# Altium schematic sheet 358漫&镜面反射.SchDoc
size 400 x 400 mm; SheetNumber: 1; SheetTotal: 1
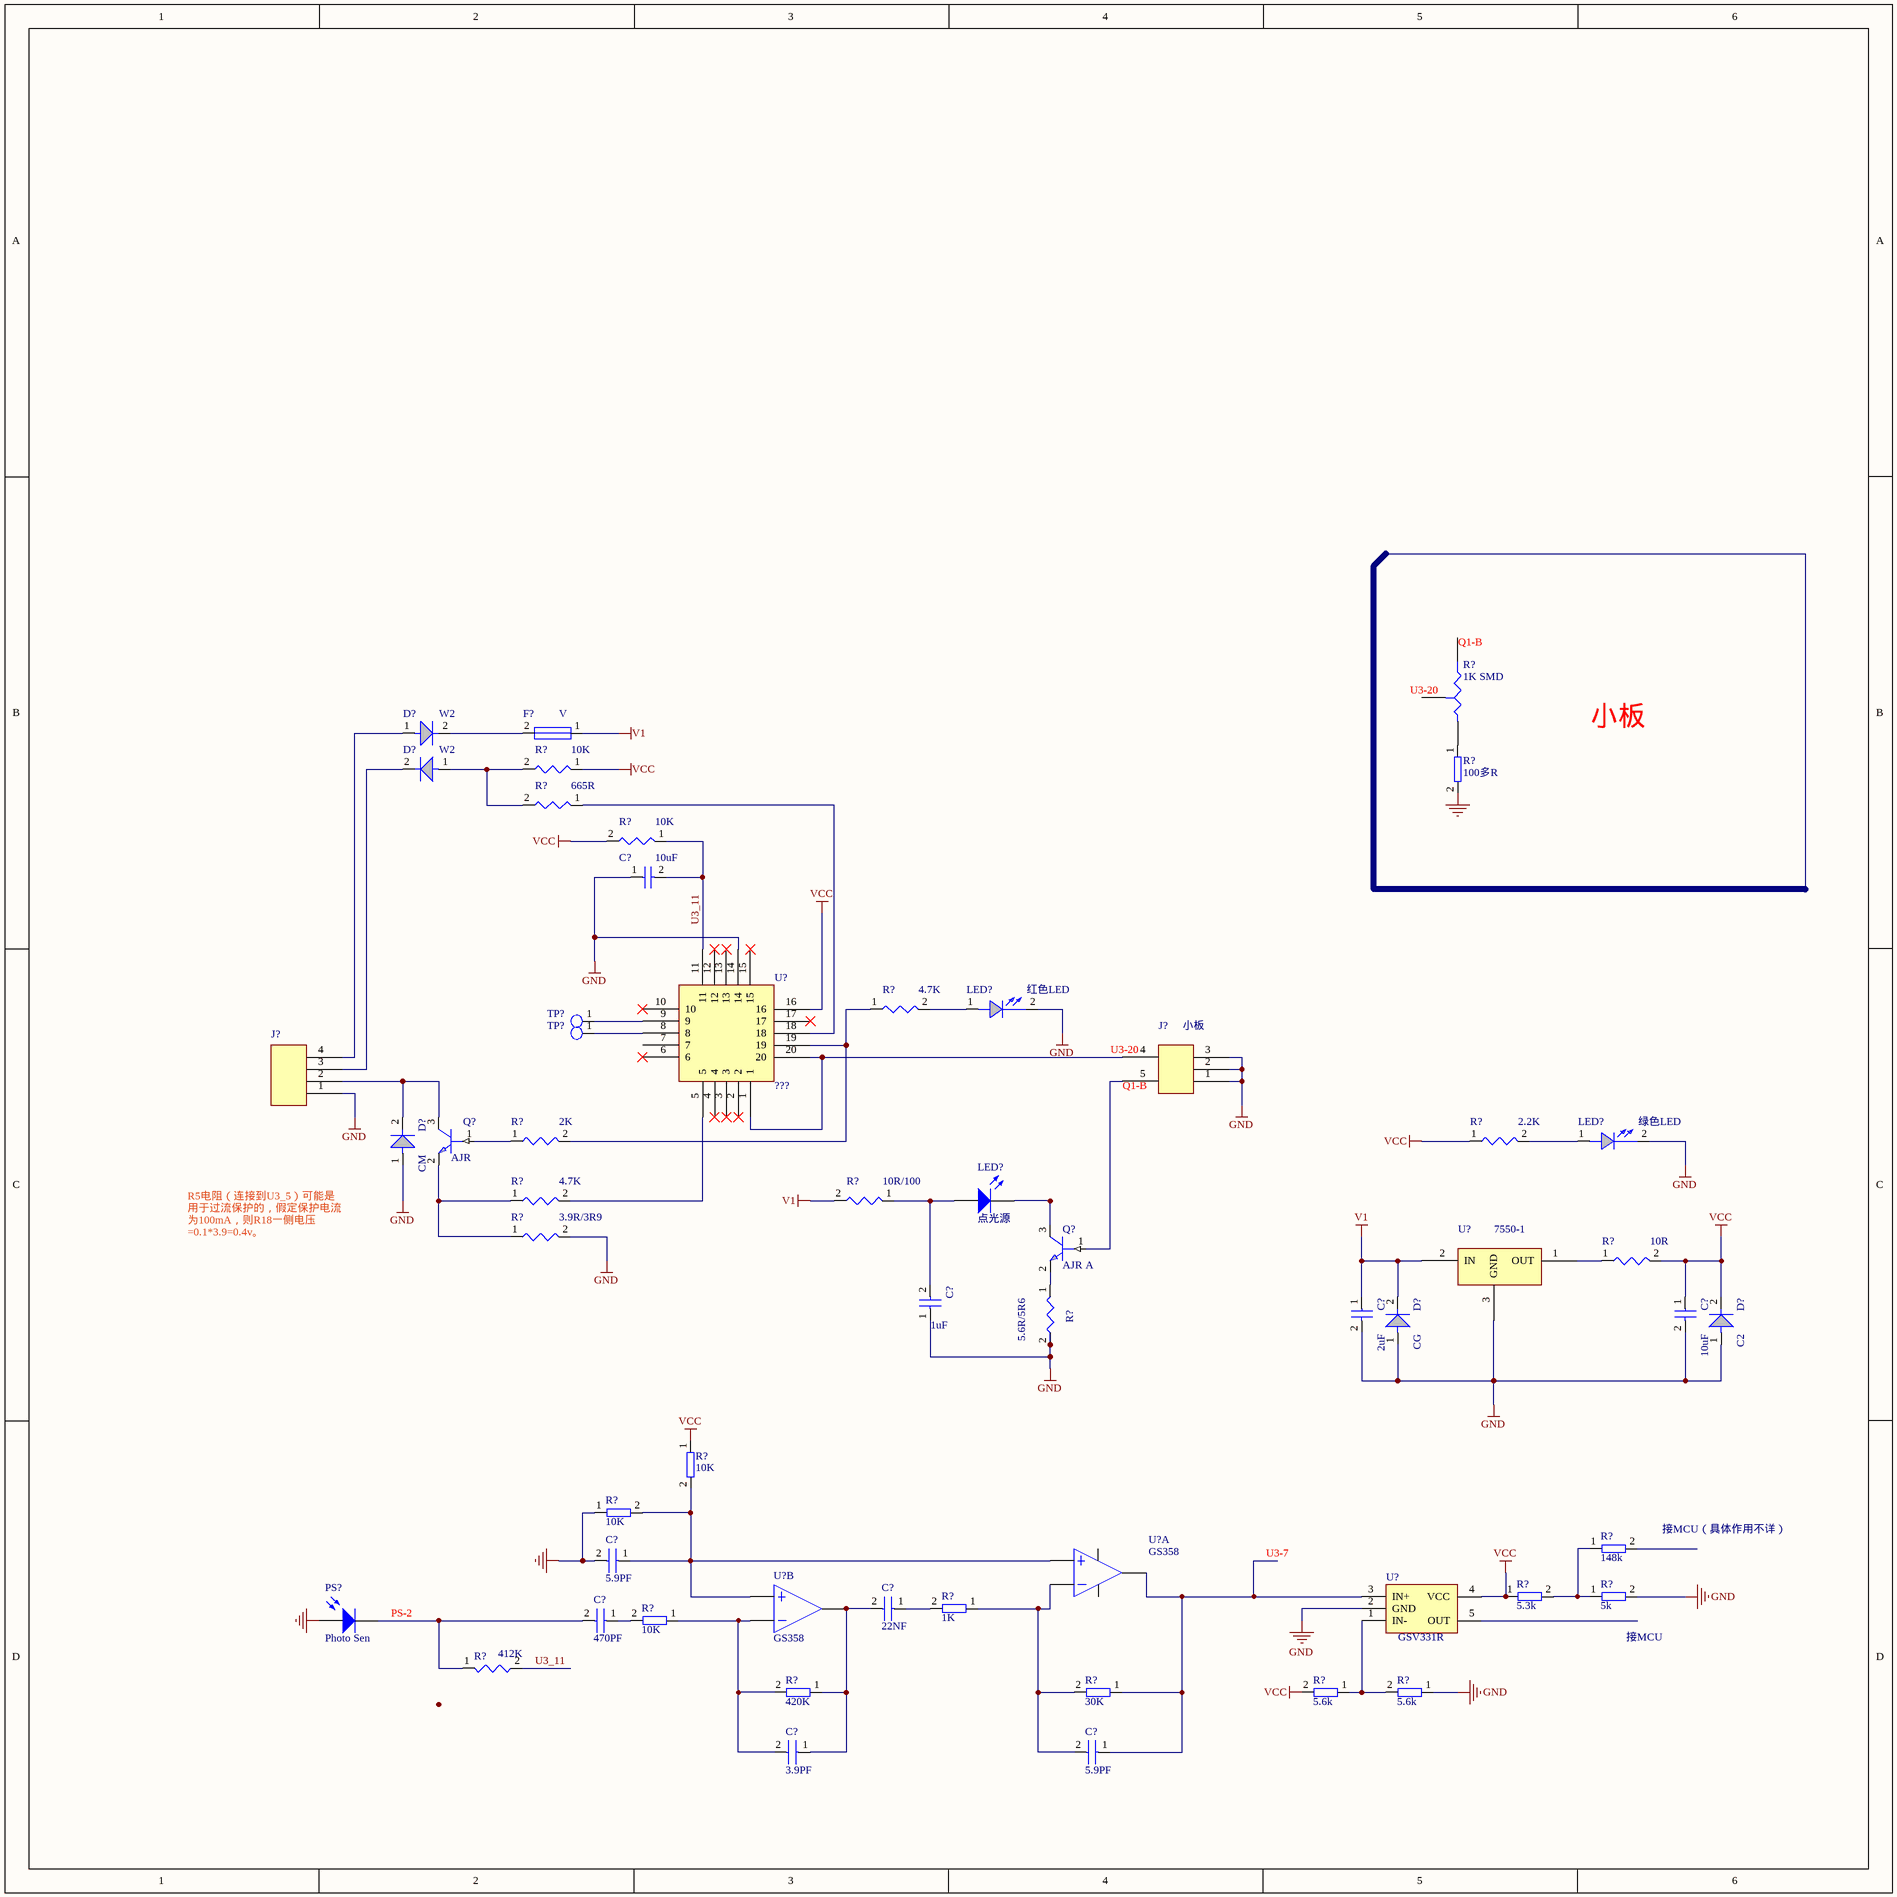
[diagram p0: 358漫&镜面反射.SchDoc]

## Parts
(Parts that share a designator on the sheet are numbered #1, #2 ... from top to bottom, then left to right.)
C?#1  10uF  [0603]
C?#2  1uF  [1206]
C?#3  2uF  [1206]
C?#4  10uF  [0603]
C?#5  5.9PF
C?#6  22NF
C?#7  470PF
C?#8  3.9PF
C?#9  5.9PF
D?#1  W2  [0805]
D?#2  W2  [0805]
D?#3  CM  [1206]
D?#4  CG  [1206]
D?#5  C2  [0805]
F?  V  [0805]
J?#1  小板  [SIP5P]
J?#2  (no value)  [SIP4]
LED?#1  红色LED  [0603V]
LED?#2  绿色LED  [0603V]
LED?#3  点光源  [LED-0]
PS?  Photo Sen  [PIN2]
Q?#1  AJR  [SOT-23]
Q?#2  AJR A  [SOT-23]
R?#1  value 1K SMD  [VR3]  (hidden comment: Res Tap)
R?#2  100多R
R?#3  10K  [0402]
R?#4  665R  [0402]
R?#5  10K  [0402]
R?#6  4.7K  [0402]
R?#7  2K  [0402]
R?#8  2.2K  [0402]
R?#9  4.7K  [0402]
R?#10  10R/100  [0603]
R?#11  3.9R/3R9  [0805]
R?#12  10R  [0402]
R?#13  5.6R/5R6  [0603V]
R?#14  10K
R?#15  10K
R?#16  148k
R?#17  5.3k
R?#18  5k
R?#19  1K
R?#20  10K
R?#21  412K  [0402]
R?#22  420K
R?#23  30K
R?#24  5.6k
R?#25  5.6k
TP?#1  (no value)  [SIP1]
TP?#2  (no value)  [SIP1]
U?#1  ???  [QFN20]
U?#2  7550-1  [SOT89]
U?#3  GS358  [SOP-8]  (part A of 2)
U?#4  GS358  [SOP-8]  (part B of 2)
U?#5  GSV331R  [SC70]

## Nets
GND: C?#1.1 C?#2.1 C?#3.2 C?#4.2 C?#5.2 D?#3.1 D?#4.1 D?#5.1 J?#1.1 J?#1.2 J?#1.3 J?#2.1 LED?#1.2(CATHODE) LED?#2.2(CATHODE) PS?.1(A) R?#2.2 R?#11.2 R?#13.2 R?#15.1 R?#18.2 R?#25.1 U?#1.14 U?#2.3(GND) U?#5.2(GND)
V1: C?#3.1 D?#4.2 F?.1 R?#10.2 U?#2.2(IN)
VCC: C?#4.1 D?#5.2 R?#3.1 R?#5.2 R?#8.1 R?#12.2 R?#14.1 R?#17.1 R?#24.2 U?#1.16 U?#5.4(VCC)
U3_11: C?#1.2 R?#5.1 R?#21.2 U?#1.11
NetC?#2_2: C?#2.2 LED?#3.1(A) R?#10.1
NetC?#5_1: C?#5.1 R?#14.2 R?#15.2 U?#3.3 U?#4.5
NetC?#6_1: C?#6.1 R?#19.2
NetC?#6_2: C?#6.2 C?#8.1 R?#22.1 U?#4.7
NetC?#7_1: C?#7.1 R?#20.2
NetC?#7_2: C?#7.2 PS?.2(K) R?#21.1
NetC?#8_2: C?#8.2 R?#20.1 R?#22.2 U?#4.6
NetC?#9_1: C?#9.1 R?#23.1 U?#3.1 U?#5.3(IN+)
NetC?#9_2: C?#9.2 R?#19.1 R?#23.2 U?#3.2
NetD?#1_1: D?#1.1 J?#2.4
NetD?#1_2: D?#1.2 F?.2
NetD?#2_1: D?#2.1 R?#3.2 R?#4.2
NetD?#2_2: D?#2.2 J?#2.3
NetD?#3_2: D?#3.2 J?#2.2 Q?#1.3(COLLECTOR)
NetJ?#1_4: J?#1.4 U?#1.1 U?#1.20
NetJ?#1_5: J?#1.5 Q?#2.1(BASE)
NetLED?#1_1: LED?#1.1(ANODE) R?#6.2
NetLED?#2_1: LED?#2.1(ANODE) R?#8.2
NetLED?#3_2: LED?#3.2(K) Q?#2.3(COLLECTOR)
NetQ?#1_1: Q?#1.1(BASE) R?#7.1
NetQ?#1_2: Q?#1.2(EMITTER) R?#9.1 R?#11.1
NetQ?#2_2: Q?#2.2(EMITTER) R?#13.1
NetR?#1_1: R?#1.1(A) R?#2.1
NetR?#4_1: R?#4.1 U?#1.18
NetR?#6_1: R?#6.1 R?#7.2 U?#1.19
NetR?#9_2: R?#9.2 U?#1.5
NetR?#12_1: R?#12.1 U?#2.1(OUT)
NetR?#16_1: R?#16.1 R?#17.2 R?#18.1
NetR?#24_1: R?#24.1 R?#25.2 U?#5.1(IN-)
NetTP?#1_1: TP?#1.1(TP) U?#1.9
NetTP?#2_1: TP?#2.1(TP) U?#1.8

Not connected (* = marked no-connect by the designer): R?#1 2(B) 3(TAP); R?#16 2; U?#1 2* 3* 4* 6* 7 10* 12* 13* 15* 17*; U?#3 4 8; U?#5 5(OUT)

## Notes on the sheet
- (near R?#1) Q1-B
- (near R?#1) U3-20
- 小板
- (near J?#1) U3-20
- (near J?#1) Q1-B
- R5电阻（连接到U3_5）可能是用于过流保护的，假定保护电流为100mA，则R18一侧电压=0.1*3.9=0.4v。
- U3-7
- (near R?#16) 接MCU（具体作用不详）
- (near PS?) PS-2
- (near R?#18) 接MCU

## Library data of the parts
C?#1-C?#4 = CAP NP: Text Field1: 20; Text Field2: 10
C?#5-C?#9 = CAP
D?#1-D?#5 = D1N3063_0: Text Field1: 20; Text Field2: 20
F? = FUSE_0: Text Field1: 30; Text Field2: 20
J?#1 = HEADER 10_0: Text Field1: 30; Text Field2: 40
J?#2 = HEADER 1_0: Text Field1: 30; Text Field2: 50
LED?#1 LED?#2 = LED: Text Field1: 40; Text Field2: 20
LED?#3 = LED0: Typical INFRARED GaAs LED; Published: 8-Jun-2000; LatestRevisionDate: 08-Jul-2005; LatestRevisionNote: Mech Layer 1 removed.; PackageReference: LED-0; Publisher: Altium Limited; PackageDescription: LED; 2 Leads
PS? = Photo Sen: Photosensitive Diode; Published: 24-Mar-1999; LatestRevisionDate: 17-Jul-2002; LatestRevisionNote: Re-released for DXP Platform.; PackageReference: PIN2; Publisher: Altium Limited
Q?#1 Q?#2 = Q2N2369_0: Text Field1: 20; Text Field2: 20
R?#1 = Res Tap: Tapped Resistor; Sim Note: Enter the Resistance value and the set point into parameter fields.; Set Position: 0.5; Published: 24-Mar-1999; LatestRevisionDate: 17-Jul-2002; LatestRevisionNote: Re-released for DXP Platform.; PackageReference: VR3; Publisher: Altium Limited; PackageDescription: Variable Resistor, Thru-Hole; 3 Leads
R?#2 R?#14-R?#20 R?#22-R?#25 = RES
R?#3-R?#13 R?#21 = R: Text Field1: 20; Text Field2: 30
TP?#1 TP?#2 = T POINT R: Text Field1: 10; Text Field2: 20
U?#1 = 20P
U?#2 = 78XX/SM_1: Text Field1: 70; Text Field2: 30
U?#3 U?#4 = LM358
U?#5 = C65